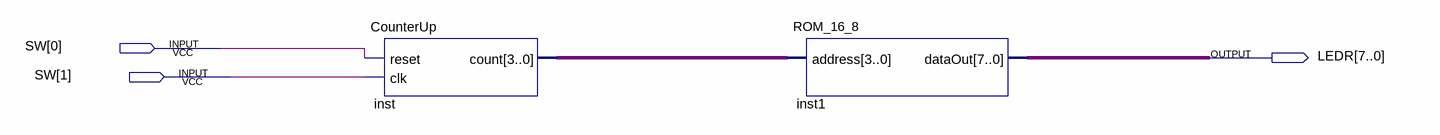
[diagram p0: schematic sheet]
// Quartus schematic ROM_Demo.bdf as structural Verilog: 2 symbols, 3 pins
module ROM_Demo (
  input  [1:0] SW,
  output [7:0] LEDR
);

  wire [3:0] inst_count;

  CounterUp inst (.reset(SW[0]), .clk(SW[1]), .count(inst_count));
  ROM_16_8 inst1 (.address(inst_count), .dataOut(LEDR));
endmodule
